# EAGLE schematic ardBeeQueen_12-pin_lcd (EAGLE 9.5.2)
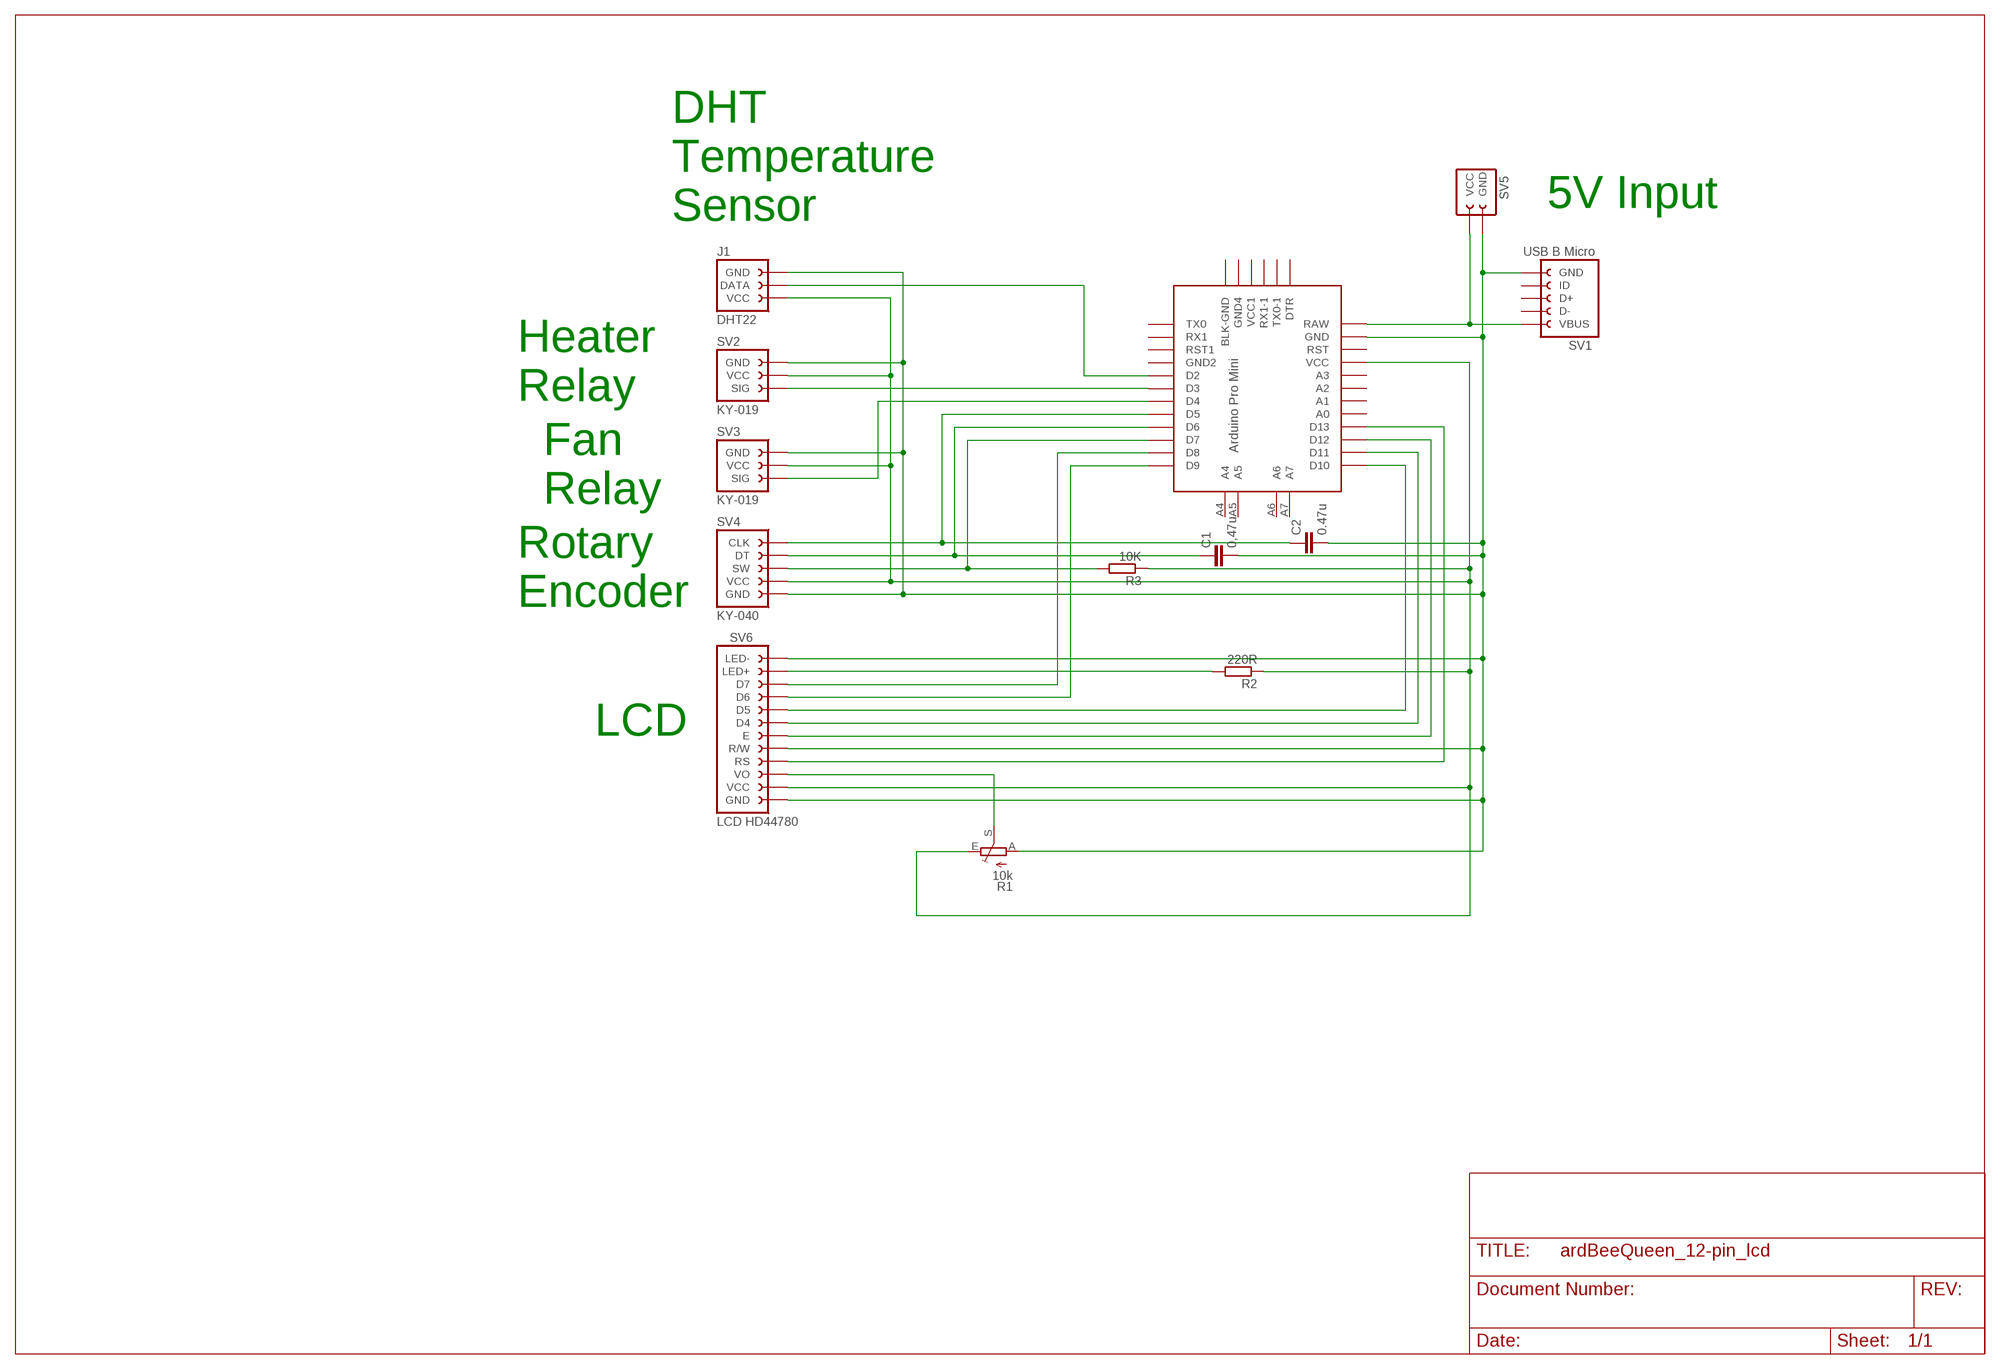
[diagram p0: schematic, sheet 1]

## Parts
C1  0,47u  C-EU050-024X044  [C050-024X044]
C2  0.47u  C-EU050-024X044  [C050-024X044]
J1  DHT22_3-PIN_FEMALE_HEADER  [DHT22_3-PIN_FEMALE_HEADER]
R1  10k  POTENTIOMETER_CA6VCA6V  [CA6V]
R2  220R  R-EU_0207/10  [0207/10]
R3  10K  R-EU_0207/10  [0207/10]
SV1  MICROUSB_B_BREAKOUT_5-PIN_FEMALE_HEADERWITH_MOUNT_HOLES  [MICROUSB_B_BREAKOUT_5-PIN_FEMALE_HEADER_W_MOUNT_HOLES]
SV2  KY-019_3-PIN_FEMALE_HEADER  [KY-019_3-PIN_FEMALE_HEADER]
SV3  KY-019_3-PIN_FEMALE_HEADER  [KY-019_3-PIN_FEMALE_HEADER]
SV4  KY-040_5-PIN_FEMALE_HEADER  [KY-040_5-PIN_FEMALE_HEADER]
SV5  POWER_IN-2-PIN_FEMALE_HEADER  [POWER_IN-2-PIN_FEMALE_HEADER]
SV6  LCD-HD44780-12-PIN_FEMALE_HEADER  [LCD-HD44780-12-PIN_FEMALE_HEADER]
U$1  ARDUINO_PRO_MINI-2  [ARDUINO_PRO_MINI-2]

## Nets
GND: C1.2 C2.2 J1.GND R1.A SV1.GND SV2.GND SV3.GND SV4.GND SV5.GND SV6.GND SV6.LED- SV6.R/W U$1.GND
N$1: R1.S SV6.VO
N$2: R2.2 SV6.LED+
N$3: SV6.D6 U$1.D9
N$4: SV6.D7 U$1.D8
N$5: SV6.D5 U$1.D10
N$6: SV6.D4 U$1.D11
N$7: SV6.E U$1.D12
N$8: SV6.RS U$1.D13
N$9: R3.2 SV4.SW U$1.D7
N$10: C1.1 SV4.DT U$1.D6
N$11: C2.1 SV4.CLK U$1.D5
N$12: J1.DATA U$1.D2
N$13: SV2.SIG U$1.D3
N$14: SV3.SIG U$1.D4
N$15: J1.VCC R1.E R2.1 R3.1 SV2.VCC SV3.VCC SV4.VCC SV6.VCC U$1.VCC
N$17: SV1.VBUS SV5.VCC U$1.RAW
Unconnected: SV1.D+ SV1.D- SV1.ID U$1.A0 U$1.A1 U$1.A2 U$1.A3 U$1.A4 U$1.A5 U$1.A6 U$1.A7 U$1.BLK-GND U$1.DTR U$1.GND1(GND2) U$1.GND3(GND4) U$1.RST U$1.RST1 U$1.RX1 U$1.RX1-1 U$1.TX0 U$1.TX0-1 U$1.VCC1

## Notes on the sheet
- 5V Input
- DHT
  Temperature
  Sensor
- Heater
  Relay
- Fan
  Relay
- Rotary
  Encoder
- LCD

## Library data of the parts
C1 C2 = rcl:C-EU: CAPACITOR, European symbol; SPICEPREFIX: C
J1 = myLib-01-Headers:DHT22_3-PIN_FEMALE_HEADER: Header for the DHT22 four pin module. Female
R1 = myLib-04-OftenUsed:POTENTIOMETER_CA6V: TRIM POTENTIOMETER Trim Potentiometer CA6V
R2 R3 = rcl:R-EU_: RESISTOR, European symbol; SPICEPREFIX: R
SV1 = myLib-01-Headers:MICROUSB_B_BREAKOUT_5-PIN_FEMALE_HEADER: Header for the micro USB five pin breakout Female
SV2 SV3 = myLib-01-Headers:KY-019_3-PIN_FEMALE_HEADER: Header for the 3 pin KY-019 arduino relay module Female https://www.keyestudio.com/free-shipping-keyestudio-single-5v-relay-module-compatible-with-arduino-uno-r3-mega-p0195-p0195.html https://tkkrlab.nl/wiki/Arduino_KY-019_5V_relay_module Board size: 27 x 34 mm Hole distances: 20.05 x 29 mm Lower edge to lower holes and in pins: 3 mm Hole diameter: 3.5 mm Lower left hole to Sig pin: 11 mm - pin to lower right hole: 4.5 mm Pins reaches 5 mm outside board edge; OC_FARNELL: unknown; OC_NEWARK: unknown
SV4 = myLib-01-Headers:KY-040_5-PIN_FEMALE_HEADER: Header for the 5 pin KY-040 arduino rotary encoder module Female https://www.keyestudio.com/free-shipping-keyestudio-rotary-rotation-encoder-module-for-arduino-p0127.html https://tkkrlab.nl/wiki/Arduino_KY-040_Rotary_encoder_module; OC_FARNELL: unknown; OC_NEWARK: unknown
SV5 = myLib-01-Headers:POWER_IN-2-PIN_FEMALE_HEADER: FEMALE HEADER
SV6 = myLib-01-Headers:LCD-HD44780-12-PIN_FEMALE_HEADER: Header for the 16 pin HD44780 LCD module Female 12-pin used
U$1 = myLib-02-Arduino:ARDUINO_PRO_MINI-2: Arduino Pro Mini Layout 2 Sparkfun.com

## Net classes
0 default: width 0.406 mm, clearance 0.152 mm